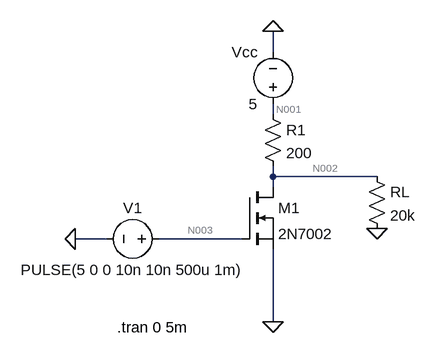
[diagram p0: schematic MOS_NOT.asc]
MOS_NOT.asc, the LTspice schematic file:
Version 4
SHEET 1 880 680
WIRE 304 -144 304 -176
WIRE 304 -48 304 -64
WIRE 304 48 304 32
WIRE 464 48 304 48
WIRE 304 64 304 48
WIRE 48 144 0 144
WIRE 256 144 128 144
WIRE 304 272 304 160
FLAG 304 272 0
FLAG 0 144 0
FLAG 304 -176 0
FLAG 464 128 0
SYMBOL voltage 304 -48 R180
WINDOW 0 24 96 Left 2
WINDOW 3 24 16 Left 2
WINDOW 123 0 0 Left 0
WINDOW 39 24 68 Left 2
SYMATTR InstName Vcc
SYMATTR Value 5
SYMBOL voltage 144 144 R90
WINDOW 0 -32 56 VBottom 2
WINDOW 3 32 56 VTop 2
WINDOW 123 0 0 Left 0
WINDOW 39 0 0 Left 0
SYMATTR InstName V1
SYMATTR Value PULSE(5 0 0 10n 10n 500u 1m)
SYMBOL res 288 -64 R0
SYMATTR InstName R1
SYMATTR Value 200
SYMBOL nmos 256 64 R0
SYMATTR InstName M1
SYMATTR Value 2N7002
SYMBOL res 448 32 R0
SYMATTR InstName RL
SYMATTR Value 20k
TEXT 64 280 Left 2 !.tran 0 5m

The netlist it stands for:
* MOS_NOT.asc
Vcc N001 0 5
V1 N003 0 PULSE(5 0 0 10n 10n 500u 1m)
R1 N001 N002 200
M1 N002 N003 0 0 2N7002
RL N002 0 20k
.model NMOS NMOS
.model PMOS PMOS
.lib standard.mos
.tran 0 5m
.backanno
.end

* Results of the author's LTspice run, read from the files saved beside the schematic
* Operating Point, zero values left out:
*   V(n001) = 5 V
*   V(n003) = 5 V
*   V(n002) = 53.19 mV
*   Id(M1) = 24.73 mA
*   Is(M1) = -24.73 mA
*   I(Rl) = 2.659 µA
*   I(R1) = 24.73 mA
*   I(Vcc) = -24.73 mA
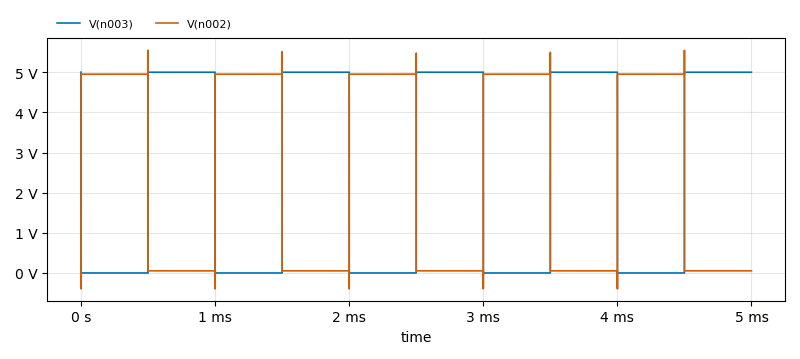
[diagram p1: Transient Analysis of MOS_NOT.asc, plotted from the saved traces]
* Transient Analysis, 1 run:
*   V(n003): min 0 V, max 5 V, average 2.5 V, rms 3.535 V, last 5 V
*   V(n002): min -394.5 mV, max 5.544 V, average 2.502 V, rms 3.501 V, last 53.19 mV